# EAGLE design apa102-breakout (EAGLE 9.2.2)

## Sheet 1 of 2
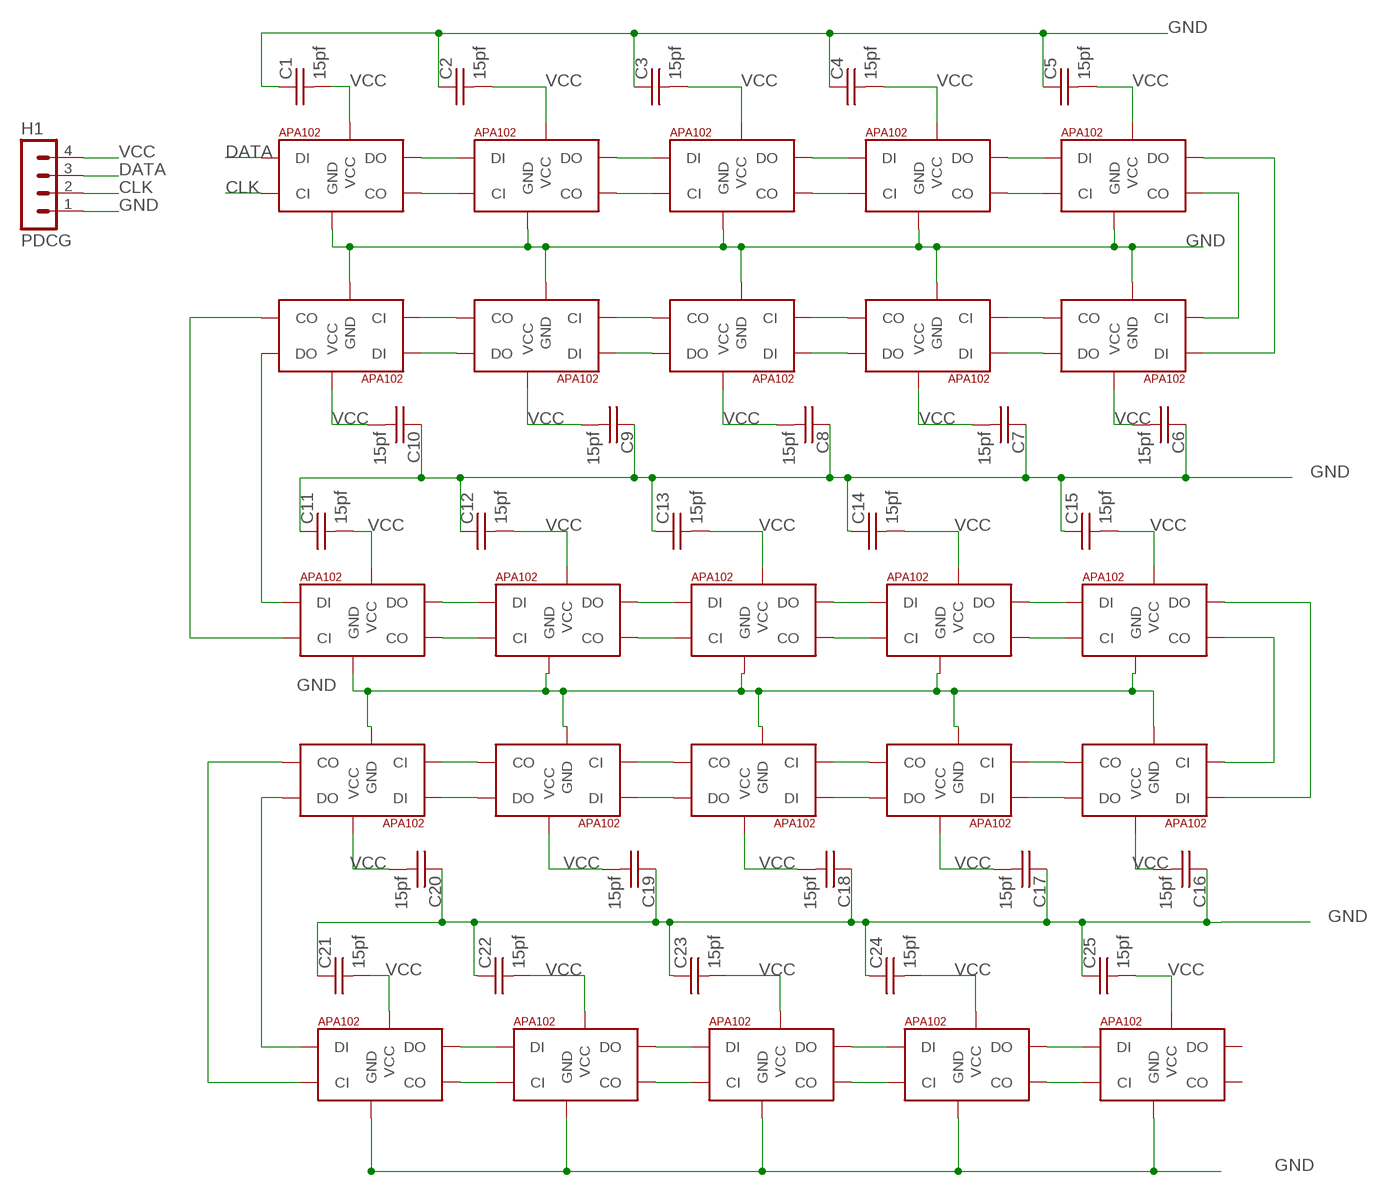
[diagram p0: schematic, sheet 1]

### Parts
C1  15pf  C-USC0805  [C0805]
C2  15pf  C-USC0805  [C0805]
C3  15pf  C-USC0805  [C0805]
C4  15pf  C-USC0805  [C0805]
C5  15pf  C-USC0805  [C0805]
C6  15pf  C-USC0805  [C0805]
C7  15pf  C-USC0805  [C0805]
C8  15pf  C-USC0805  [C0805]
C9  15pf  C-USC0805  [C0805]
C10  15pf  C-USC0805  [C0805]
C11  15pf  C-USC0805  [C0805]
C12  15pf  C-USC0805  [C0805]
C13  15pf  C-USC0805  [C0805]
C14  15pf  C-USC0805  [C0805]
C15  15pf  C-USC0805  [C0805]
C16  15pf  C-USC0805  [C0805]
C17  15pf  C-USC0805  [C0805]
C18  15pf  C-USC0805  [C0805]
C19  15pf  C-USC0805  [C0805]
C20  15pf  C-USC0805  [C0805]
C21  15pf  C-USC0805  [C0805]
C22  15pf  C-USC0805  [C0805]
C23  15pf  C-USC0805  [C0805]
C24  15pf  C-USC0805  [C0805]
C25  15pf  C-USC0805  [C0805]
H1  PDCG  MA04-1  [MA04-1]
U$2  APA1025050  [APA102_5050]
U$3  APA1025050  [APA102_5050]
U$4  APA1025050  [APA102_5050]
U$5  APA1025050  [APA102_5050]
U$6  APA1025050  [APA102_5050]
U$7  APA1025050  [APA102_5050]
U$8  APA1025050  [APA102_5050]
U$9  APA1025050  [APA102_5050]
U$10  APA1025050  [APA102_5050]
U$11  APA1025050  [APA102_5050]
U$12  APA1025050  [APA102_5050]
U$13  APA1025050  [APA102_5050]
U$14  APA1025050  [APA102_5050]
U$15  APA1025050  [APA102_5050]
U$16  APA1025050  [APA102_5050]
U$17  APA1025050  [APA102_5050]
U$18  APA1025050  [APA102_5050]
U$19  APA1025050  [APA102_5050]
U$20  APA1025050  [APA102_5050]
U$21  APA1025050  [APA102_5050]
U$22  APA1025050  [APA102_5050]
U$23  APA1025050  [APA102_5050]
U$24  APA1025050  [APA102_5050]
U$25  APA1025050  [APA102_5050]
U$26  APA1025050  [APA102_5050]

### Nets
CLK: H1.2 U$2.5(CI)
DATA: H1.3 U$2.4(DI)
GND [pwr]: C1.1 C2.1 C3.1 C4.1 C5.1 C6.1 C7.1 C8.1 C9.1 C10.1 C11.1 C12.1 C13.1 C14.1 C15.1 C16.1 C17.1 C18.1 C19.1 C20.1 C21.1 C22.1 C23.1 C24.1 C25.1 H1.1 U$2.6(GND) U$3.6(GND) U$4.6(GND) U$5.6(GND) U$6.6(GND) U$7.6(GND) U$8.6(GND) U$9.6(GND) U$10.6(GND) U$11.6(GND) U$12.6(GND) U$13.6(GND) U$14.6(GND) U$15.6(GND) U$16.6(GND) U$17.6(GND) U$18.6(GND) U$19.6(GND) U$20.6(GND) U$21.6(GND) U$22.6(GND) U$23.6(GND) U$24.6(GND) U$25.6(GND) U$26.6(GND)
N$33: U$2.3(DO) U$3.4(DI)
N$34: U$2.2(CO) U$3.5(CI)
N$35: U$3.3(DO) U$4.4(DI)
N$36: U$3.2(CO) U$4.5(CI)
N$37: U$4.3(DO) U$5.4(DI)
N$38: U$4.2(CO) U$5.5(CI)
N$39: U$5.3(DO) U$6.4(DI)
N$40: U$5.2(CO) U$6.5(CI)
N$41: U$6.3(DO) U$7.4(DI)
N$42: U$6.2(CO) U$7.5(CI)
N$43: U$7.3(DO) U$8.4(DI)
N$44: U$7.2(CO) U$8.5(CI)
N$45: U$8.2(CO) U$9.5(CI)
N$46: U$8.3(DO) U$9.4(DI)
N$47: U$9.2(CO) U$10.5(CI)
N$48: U$9.3(DO) U$10.4(DI)
N$49: U$10.2(CO) U$11.5(CI)
N$50: U$10.3(DO) U$11.4(DI)
N$51: U$11.2(CO) U$12.5(CI)
N$52: U$11.3(DO) U$12.4(DI)
N$53: U$12.3(DO) U$13.4(DI)
N$54: U$12.2(CO) U$13.5(CI)
N$55: U$13.3(DO) U$14.4(DI)
N$56: U$13.2(CO) U$14.5(CI)
N$57: U$14.3(DO) U$15.4(DI)
N$58: U$14.2(CO) U$15.5(CI)
N$59: U$15.3(DO) U$16.4(DI)
N$60: U$15.2(CO) U$16.5(CI)
N$61: U$16.3(DO) U$17.4(DI)
N$62: U$16.2(CO) U$17.5(CI)
N$64: U$17.3(DO) U$18.4(DI)
N$65: U$17.2(CO) U$18.5(CI)
N$66: U$18.2(CO) U$19.5(CI)
N$67: U$18.3(DO) U$19.4(DI)
N$68: U$19.2(CO) U$20.5(CI)
N$69: U$19.3(DO) U$20.4(DI)
N$70: U$20.2(CO) U$21.5(CI)
N$71: U$20.3(DO) U$21.4(DI)
N$72: U$21.3(DO) U$22.4(DI)
N$73: U$21.2(CO) U$22.5(CI)
N$75: U$22.3(DO) U$23.4(DI)
N$76: U$22.2(CO) U$23.5(CI)
N$77: U$23.3(DO) U$24.4(DI)
N$78: U$23.2(CO) U$24.5(CI)
N$79: U$24.3(DO) U$25.4(DI)
N$80: U$24.2(CO) U$25.5(CI)
N$81: U$25.3(DO) U$26.4(DI)
N$82: U$25.2(CO) U$26.5(CI)
VCC [pwr]: C1.2 C2.2 C3.2 C4.2 C5.2 C6.2 C7.2 C8.2 C9.2 C10.2 C11.2 C12.2 C13.2 C14.2 C15.2 C16.2 C17.2 C18.2 C19.2 C20.2 C21.2 C22.2 C23.2 C24.2 C25.2 H1.4 U$2.1(VCC) U$3.1(VCC) U$4.1(VCC) U$5.1(VCC) U$6.1(VCC) U$7.1(VCC) U$8.1(VCC) U$9.1(VCC) U$10.1(VCC) U$11.1(VCC) U$12.1(VCC) U$13.1(VCC) U$14.1(VCC) U$15.1(VCC) U$16.1(VCC) U$17.1(VCC) U$18.1(VCC) U$19.1(VCC) U$20.1(VCC) U$21.1(VCC) U$22.1(VCC) U$23.1(VCC) U$24.1(VCC) U$25.1(VCC) U$26.1(VCC)
Unconnected: U$26.2(CO) U$26.3(DO)

## Sheet 2 of 2
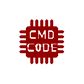
[diagram p1: schematic, sheet 2]

### Parts
U$1  CMD_C0DE_LOGOCMD_C0DE_LOGO_TOP  [CMD_C0DE_LOGO_TOP]

## Library data of the parts
C1-C25 = apa102-test-board:C-US: CAPACITOR, American symbol
H1 = apa102-test-board:MA04-1: PIN HEADER; OC_FARNELL: unknown; OC_NEWARK: unknown
U$1 = apa102-test-board:CMD_C0DE_LOGO
U$2-U$26 = apa102-test-board:APA102: APA102C 5050 RGB LED -- Adafruit DotStar Single LED Pixel Product Page: https://www.adafruit.com/products/2343 Datasheet: https://cdn-shop.adafruit.com/product-files/2343/APA102C.pdf

## Net classes
1 pwr: width 0.406 mm

## Board
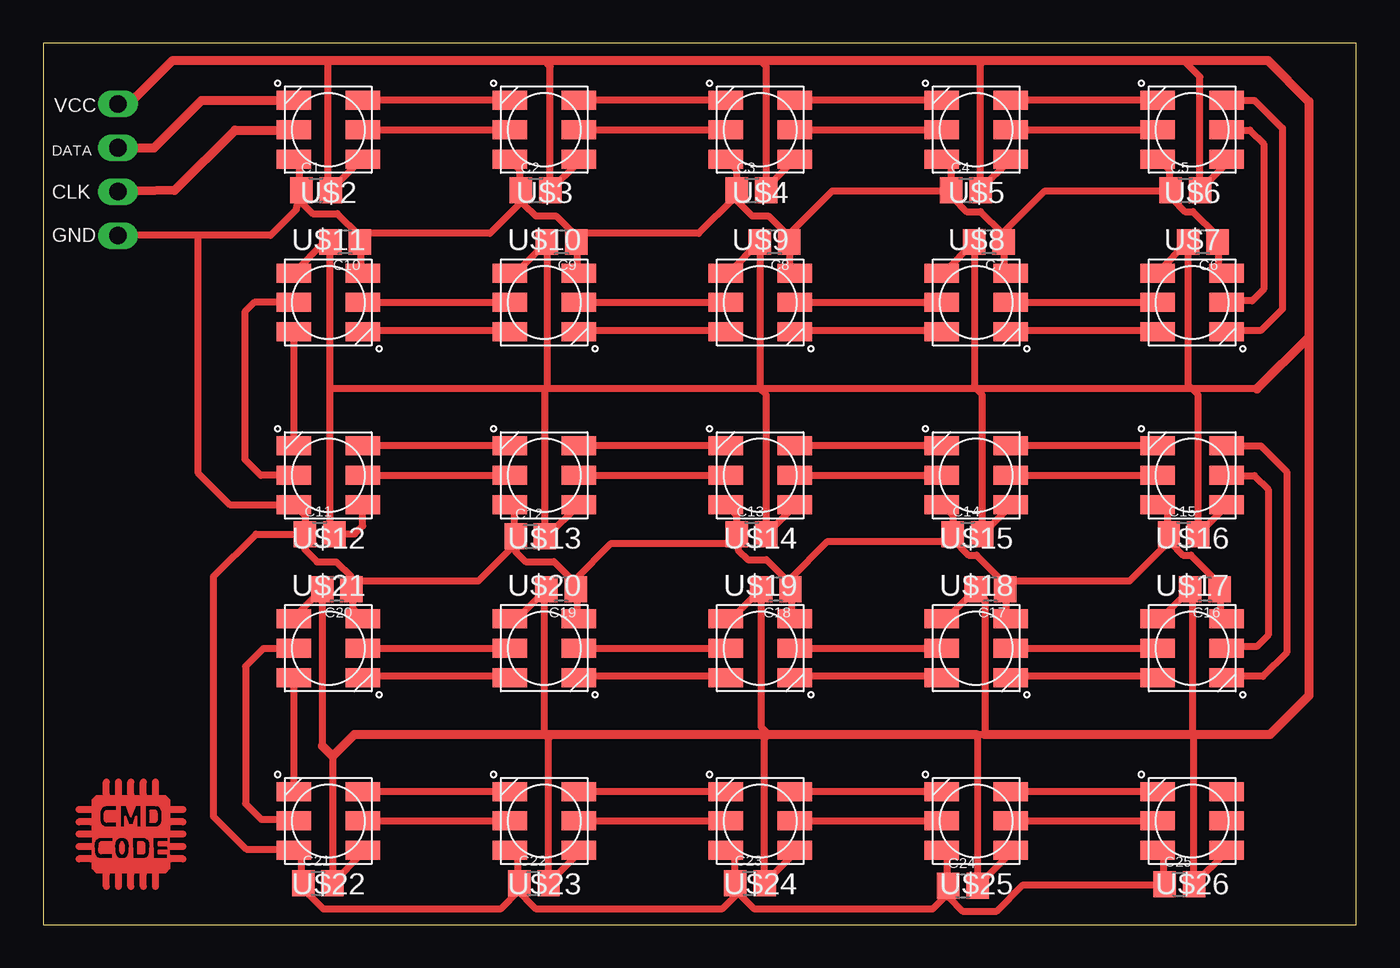
[diagram p2: board, top side]
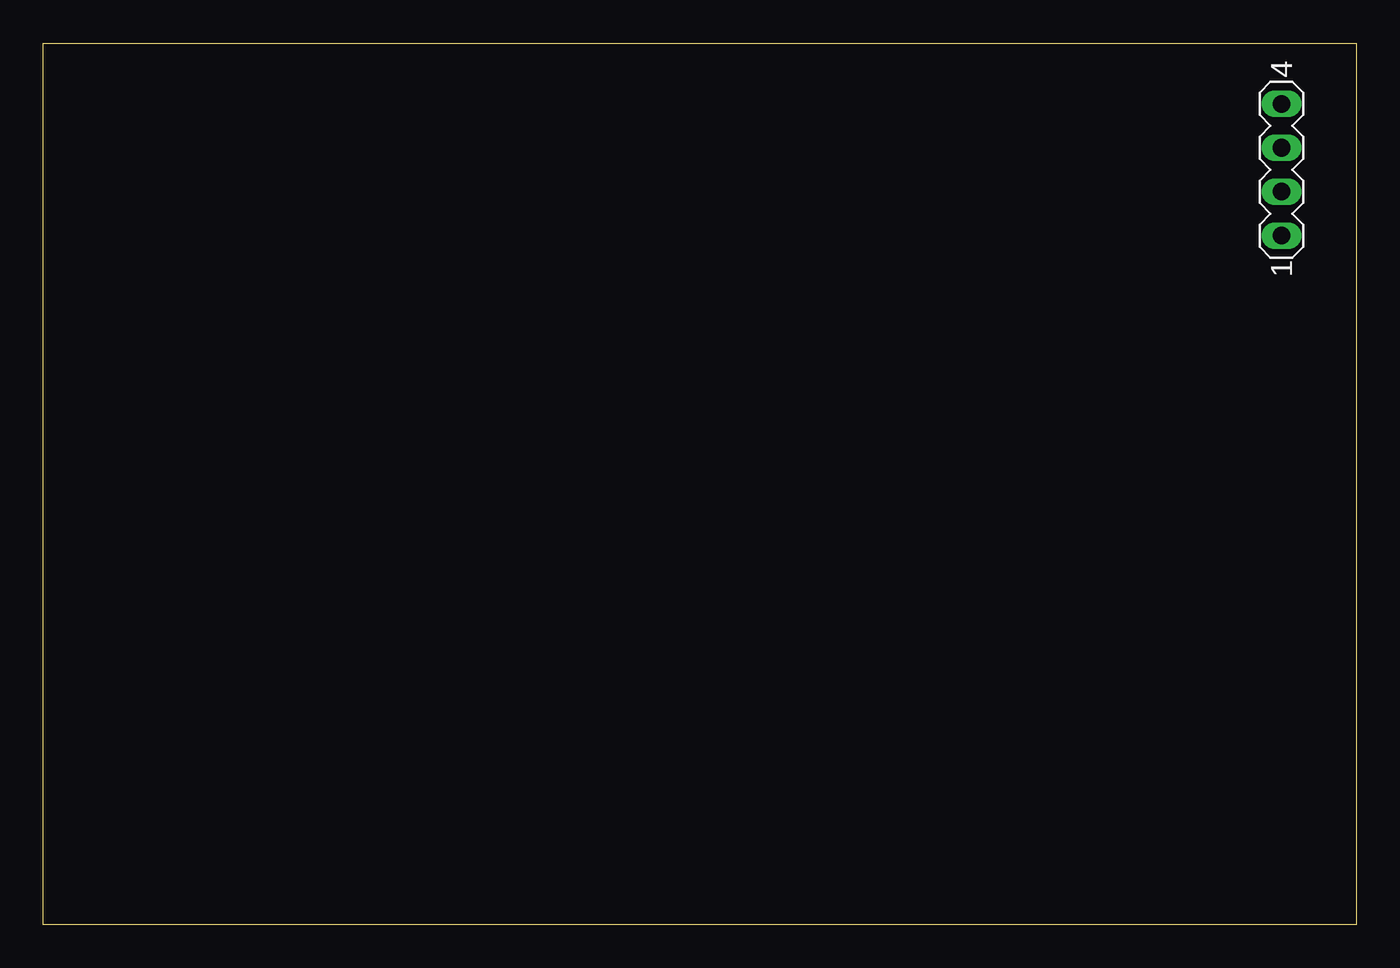
[diagram p3: board, bottom side, seen from below]

Size 76 x 51 mm. Coordinates in mm from the lower left corner, seen from the top.
Outline: 0,0 76,0 76,51 0,51 0,0
Copper layers (1*16): Top 0.035mm / dielectric 1.5mm / Bottom 0.035mm
Design rules "OthermillDRC_1_100_v2 *": minimum track width 8mil, minimum drill 0.8mm, track to track 0.256540625mm, track to pad 0.256540625mm, pad to pad 0.256540625mm, via to via 0.256540625mm, smd to smd 0mil, copper to edge 0mil, drill to drill 1mil, minimum pad ring 10mil, minimum via ring 10mil, stop-mask expansion 1mil, vias tented up to drill 30mil, thermal gap 10mil

### Footprints (pad centres in the part's own frame; a part is rotated, then mirrored left to right if it is on the bottom)
C0805 = smd 1.3 x 1.5: 1 -0.85,0; 2 0.85,0
MA04-1 = drill 1.016 long: 1 -3.81,0; 2 -1.27,0; 3 1.27,0; 4 3.81,0
APA102_5050 = smd 2 x 1.1: 1 2,-1.7; 2 2,0; 3 2,1.7; 4 -2,1.7; 5 -2,0; 6 -2,-1.7

### Placement (x,y rotation side)
C1  15.79,42.5 0 top
C2  28.5,42.5 0 top
C3  41,42.5 0 top
C4  53.4,42.5 0 top
C5  66.1,42.5 0 top
C6  67.11,39.5 180 top
C7  54.74,39.5 180 top
C8  42.32,39.5 180 top
C9  30,39.5 180 top
C10  17.48,39.5 180 top
C11  16,22.6 0 top
C12  28.19,22.47 0 top
C13  41,22.6 0 top
C14  53.5,22.6 0 top
C15  66,22.6 0 top
C16  67.24,19.4 180 top
C17  54.82,19.4 180 top
C18  42.4,19.4 180 top
C19  29.98,19.4 180 top
C20  17,19.4 180 top
C21  15.9,2.4 0 top
C22  28.4,2.4 0 top
C23  40.9,2.4 0 top
C24  53.24,2.26 0 top
C25  65.76,2.34 0 top
H1  4.33,43.68 90 bottom
U$1  5.08,5.55 0 top
U$2  16.5,46 0 top
U$3  29,46 0 top
U$4  41.5,46 0 top
U$5  54,46 0 top
U$6  66.5,46 0 top
U$7  66.5,36 180 top
U$8  54,36 180 top
U$9  41.5,36 180 top
U$10  29,36 180 top
U$11  16.5,36 180 top
U$12  16.5,26 0 top
U$13  29,26 0 top
U$14  41.5,26 0 top
U$15  54,26 0 top
U$16  66.5,26 0 top
U$17  66.5,16 180 top
U$18  54,16 180 top
U$19  41.5,16 180 top
U$20  29,16 180 top
U$21  16.5,16 180 top
U$22  16.5,6 0 top
U$23  29,6 0 top
U$24  41.5,6 0 top
U$25  54,6 0 top
U$26  66.5,6 0 top

### Tracks (layer width: path | path; a pad name or v marks a point on that pad's centre or on a via)
CLK
  Top 0.203: 14.48,45.97 U$2.5
  Top 0.508: 14.48,45.97 11.11,45.97 7.61,42.48 H1.2
DATA
  Top 0.203: 14.48,47.7 U$2.4
  Top 0.508: 14.48,47.7 9.17,47.7 6.42,44.95 H1.3
GND
  Top 0.406: C10.1 18.39,39.42 18.39,37.81 U$11.6 | C1.1 14.83,42.53 14.83,44.02 14.6,44.25 U$2.6 | C10.1 18.27,39.65 18.27,39.88 17.02,41.13 15.61,41.13 14.94,41.8 14.94,42.3 C1.1 | 8.95,39.88 13.15,39.88 14.65,41.38 C1.1 | 8.95,39.88 4.37,39.88 H1.1 | U$7.6 68.39,37.81 68.04,38.16 68.04,39.42 C6.1 67.93,39.65 67.93,39.88 66.55,41.26 66.09,41.26 65.28,42.07 65.28,42.3 C5.1 | C5.1 65.17,42.53 65.17,43.67 64.59,44.25 U$6.6 | C7.1 55.63,39.42 55.63,38.16 55.97,37.81 U$8.6 | C4.1 52.52,42.53 52.52,43.79 52.06,44.25 U$5.6 | C7.1 55.51,39.65 55.51,40 54.25,41.26 53.44,41.26 52.64,42.07 52.64,42.41 C4.1 | C9.1 30.92,39.42 30.92,37.81 U$10.6 | C2.1 27.58,42.53 27.58,43.67 27.01,44.25 U$3.6 | C9.1 30.8,39.65 30.8,39.88 29.68,41.01 28.5,41.01 27.81,41.7 27.81,42.41 C2.1 | C8.1 43.22,39.42 43.22,38.04 43.45,37.81 U$9.6 | C3.1 40.11,42.53 40.11,43.67 39.54,44.25 U$4.6 | C8.1 43.1,39.65 43.1,39.88 41.98,41.01 41.03,41.01 40.11,41.93 40.11,42.3 C3.1 | C9.1 30.92,40 37.93,40 40,42.07 C3.1 | C4.1 52.55,42.46 45.68,42.46 43.22,40 C8.1 | C5.1 65.24,42.46 57.98,42.46 55.63,40.11 C7.1 | C10.1 18.39,40 25.86,40 27.7,41.84 C2.1 | C22.1 27.47,2.41 27.47,3.79 27.01,4.25 U$23.6 | C22.1 27.55,1.99 26.46,0.9 16.23,0.9 15.17,1.95 15.17,2.3 C21.1 14.94,2.41 14.94,3.91 14.6,4.25 U$22.6 14.37,4.37 11.75,4.37 9.86,6.25 9.86,20.15 12.31,22.6 C11.1 | C23.1 40,2.41 40,3.79 39.54,4.25 U$24.6 | U$26.6 64.59,4.25 64.82,4.02 64.82,2.41 C25.1 64.71,2.3 56.71,2.3 55.19,0.78 53.22,0.78 52.41,1.58 52.41,2.07 C24.1 | C24.1 52.3,2.3 52.3,4.02 52.06,4.25 U$25.6 | C23.1 40.23,2.3 40.23,1.84 41.17,0.9 51.47,0.9 52.3,1.72 C24.1
  Top 0.406: C22.1 27.35,2.07 28.53,0.9 39.28,0.9 40.11,1.72 C23.1 | C17.1 55.74,19.31 55.74,18.05 55.97,17.82 U$18.6 | C14.1 52.64,22.64 52.64,23.68 52.06,24.25 U$15.6 | C17.1 55.63,19.54 55.63,19.77 54.02,21.38 53.56,21.38 52.64,22.3 52.64,22.41 C14.1 | U$17.6 68.39,17.82 68.16,18.05 68.16,19.31 C16.1 68.04,19.54 68.04,19.77 66.43,21.38 65.97,21.38 65.17,22.18 65.17,22.41 C15.1 | C15.1 65.05,22.64 65.05,23.79 64.59,24.25 U$16.6 | C17.1 55.74,19.88 62.87,19.88 65.05,22.07 C15.1 | C18.1 43.33,19.31 43.33,17.93 43.45,17.82 U$19.6 | C13.1 40.11,22.64 40.11,23.68 39.54,24.25 U$14.6 | C18.1 43.1,19.54 43.1,19.88 41.86,21.12 40.78,21.12 40.23,21.67 40.23,22.41 C13.1 | C20.1 17.93,19.31 17.93,18.27 18.39,17.82 U$21.6 | C20.1 17.82,19.54 17.82,20.15 16.97,21 15.85,21 15.15,21.7 C11.1 | C19.1 30.92,19.31 30.92,17.82 U$20.6 | C12.1 27.24,22.53 27.24,24.02 27.01,24.25 U$13.6 | C19.1 30.69,19.54 30.69,19.88 29.56,21.01 27.91,21.01 27.35,21.56 27.35,22.3 C12.1 | C20.1 17.93,19.88 25.17,19.88 27.24,21.95 C12.1 | C13.1 40.11,22.07 32.87,22.07 30.8,20 C19.1 | C14.1 52.52,22.18 45.4,22.18 43.22,20 C18.1 | 8.95,39.88 8.95,26.15 10.8,24.3 U$12.6 15.15,23.65 C11.1
N$33
  Top 0.203: U$2.3 | 26.89,47.7 U$3.4
  Top 0.406: 26.89,47.7 U$2.3
N$34
  Top 0.203: 18.5,45.97 U$2.2 | 26.89,45.97 U$3.5
  Top 0.406: 26.89,45.97 18.5,45.97
N$35
  Top 0.203: 31.03,47.7 U$3.3 | 39.42,47.7 U$4.4
  Top 0.406: 39.42,47.7 31.03,47.7
N$36
  Top 0.203: 31.03,45.97 U$3.2 | 39.42,45.97 U$4.5
  Top 0.406: 39.42,45.97 31.03,45.97
N$37
  Top 0.203: 43.56,47.7 U$4.3 | 51.95,47.7 U$5.4
  Top 0.406: 51.95,47.7 43.56,47.7
N$38
  Top 0.203: 43.56,45.97 U$4.2 | 51.95,45.97 U$5.5
  Top 0.406: 51.95,45.97 43.56,45.97
N$39
  Top 0.203: 56.09,47.7 U$5.3 | 64.48,47.7 U$6.4
  Top 0.406: 64.48,47.7 56.09,47.7
N$40
  Top 0.203: 56.09,45.97 U$5.2 | 64.48,45.97 U$6.5
  Top 0.406: 64.48,45.97 56.09,45.97
N$41
  Top 0.203: 68.5,34.37 U$7.4 | U$6.3
  Top 0.406: 68.5,34.37 70.46,34.37 71.72,35.62 71.72,46.08 70.1,47.7 U$6.3
N$42
  Top 0.203: 68.5,36.09 U$7.5 | 68.5,45.97 U$6.2
  Top 0.406: 68.5,36.09 69.98,36.09 70.64,36.76 70.64,45.18 69.85,45.97 68.5,45.97
N$43
  Top 0.203: 56.09,34.37 U$8.4 | 64.48,34.37 U$7.3
  Top 0.406: 64.48,34.37 56.09,34.37
N$44
  Top 0.203: 56.09,35.97 U$8.5 | 64.48,35.97 U$7.2
  Top 0.406: 64.48,35.97 56.09,35.97
N$45
  Top 0.203: 43.56,35.97 U$9.5 | 51.95,35.97 U$8.2
  Top 0.406: 51.95,35.97 43.56,35.97
N$46
  Top 0.203: 43.56,34.37 U$9.4 | 51.95,34.37 U$8.3
  Top 0.406: 51.95,34.37 43.56,34.37
N$47
  Top 0.203: 31.03,35.97 U$10.5 | 39.42,35.97 U$9.2
  Top 0.406: 39.42,35.97 31.03,35.97
N$48
  Top 0.203: 31.03,34.37 U$10.4 | 39.42,34.37 U$9.3
  Top 0.406: 39.42,34.37 31.03,34.37
N$49
  Top 0.203: 18.5,35.97 U$11.5 | 26.89,35.97 U$10.2
  Top 0.406: 26.89,35.97 18.5,35.97
N$50
  Top 0.203: 18.5,34.37 U$11.4 | 26.89,34.37 U$10.3
  Top 0.406: 26.89,34.37 18.5,34.37
N$51
  Top 0.406: U$11.2 12.21,36 11.67,35.46 11.67,26.93 12.6,26 U$12.5
N$52
  Top 0.203: 14.48,27.81 U$12.4 | 14.48,34.25 U$11.3
  Top 0.406: 14.48,34.25 14.48,27.81
N$53
  Top 0.203: U$12.3 | 26.89,27.7 U$13.4
  Top 0.406: 26.89,27.7 U$12.3
N$54
  Top 0.203: 18.5,25.98 U$12.2 | 26.89,25.98 U$13.5
  Top 0.406: 26.89,25.98 18.5,25.98
N$55
  Top 0.203: 31.03,27.7 U$13.3 | 39.42,27.7 U$14.4
  Top 0.406: 39.42,27.7 31.03,27.7
N$56
  Top 0.203: 31.03,25.98 U$13.2 | 39.42,25.98 U$14.5
  Top 0.406: 39.42,25.98 31.03,25.98
N$57
  Top 0.203: 43.56,27.7 U$14.3 | 51.95,27.7 U$15.4
  Top 0.406: 51.95,27.7 43.56,27.7
N$58
  Top 0.203: 43.56,25.98 U$14.2 | 51.95,25.98 U$15.5
  Top 0.406: 51.95,25.98 43.56,25.98
N$59
  Top 0.203: 56.09,27.7 U$15.3 | 64.48,27.7 U$16.4
  Top 0.406: 64.48,27.7 56.09,27.7
N$60
  Top 0.203: 56.09,25.98 U$15.2 | 64.48,25.98 U$16.5
  Top 0.406: 64.48,25.98 56.09,25.98
N$61
  Top 0.203: 68.5,14.37 U$17.4 | U$16.3
  Top 0.406: 68.5,14.37 70.6,14.37 71.96,15.73 71.96,26.22 70.48,27.7 U$16.3
N$62
  Top 0.203: 68.5,16.09 U$17.5 | 68.5,25.98 U$16.2
  Top 0.406: 68.5,16.09 70.23,16.09 70.9,16.76 70.9,25.18 70.1,25.98 68.5,25.98
N$64
  Top 0.203: 56.09,14.37 U$18.4 | 64.48,14.37 U$17.3
  Top 0.406: 64.48,14.37 56.09,14.37
N$65
  Top 0.203: 56.09,15.98 U$18.5 | 64.48,15.98 U$17.2
  Top 0.406: 64.48,15.98 56.09,15.98
N$66
  Top 0.203: 43.56,15.98 U$19.5 | 51.95,15.98 U$18.2
  Top 0.406: 51.95,15.98 43.56,15.98
N$67
  Top 0.203: 43.56,14.37 U$19.4 | 51.95,14.37 U$18.3
  Top 0.406: 51.95,14.37 43.56,14.37
N$68
  Top 0.203: 31.03,15.98 U$20.5 | 39.42,15.98 U$19.2
  Top 0.406: 39.42,15.98 31.03,15.98
N$69
  Top 0.203: 31.03,14.37 U$20.4 | 39.42,14.37 U$19.3
  Top 0.406: 39.42,14.37 31.03,14.37
N$70
  Top 0.203: 18.5,15.98 U$21.5 | 26.89,15.98 U$20.2
  Top 0.406: 26.89,15.98 18.5,15.98
N$71
  Top 0.203: 18.5,14.37 U$21.4 | 26.89,14.37 U$20.3
  Top 0.406: 26.89,14.37 18.5,14.37
N$72
  Top 0.203: 14.48,7.7 U$22.4 | 14.48,14.25 U$21.3
  Top 0.406: 14.48,14.25 14.48,7.7
N$73
  Top 0.203: 14.48,6.09 U$22.5 | 14.48,15.98 U$21.2
  Top 0.406: 14.48,6.09 12.62,6.09 11.71,7.01 11.71,14.94 12.74,15.98 14.48,15.98
N$75
  Top 0.203: U$22.3 | 26.89,7.7 U$23.4
  Top 0.406: 26.89,7.7 U$22.3
N$76
  Top 0.203: 18.5,5.98 U$22.2 | 26.89,5.98 U$23.5
  Top 0.406: 26.89,5.98 18.5,5.98
N$77
  Top 0.203: 31.03,7.7 U$23.3 | 39.42,7.7 U$24.4
  Top 0.406: 39.42,7.7 31.03,7.7
N$78
  Top 0.203: 31.03,5.98 U$23.2 | 39.42,5.98 U$24.5
  Top 0.406: 39.42,5.98 31.03,5.98
N$79
  Top 0.203: 43.56,7.7 U$24.3 | 51.95,7.7 U$25.4
  Top 0.406: 51.95,7.7 43.56,7.7
N$80
  Top 0.203: 43.56,5.98 U$24.2 | 51.95,5.98 U$25.5
  Top 0.406: 51.95,5.98 43.56,5.98
N$81
  Top 0.203: 56.09,7.7 U$25.3 | 64.48,7.7 U$26.4
  Top 0.406: 64.48,7.7 56.09,7.7
N$82
  Top 0.203: 56.09,5.98 U$25.2 | 64.48,5.98 U$26.5
  Top 0.406: 64.48,5.98 56.09,5.98
VCC
  Top 0.406: H1.4 4.99,47.49 | 70.25,31 66.5,31 | 66.5,31 54,31 | 54,31 41.5,31 | 41.5,31 29,31 | U$17.1 64.69,17.7 C16.2 66.5,19.29 66.5,11 66.61,10.89 C25.2 68.5,4.23 U$26.1 | 16.5,50 16.5,42.64 C1.2 18.44,44.3 U$2.1 | 29,50 29.35,49.65 C2.2 31,44.15 U$3.1 | 41.5,50 41.85,49.65 C3.2 41.85,42.65 U$4.1 | 54,50 54.25,49.75 C4.2 54.25,42.55 U$5.1 | 66,50 66.95,49.05 C5.2 68.5,44.05 U$6.1 | 66.5,31 66.26,31.24 C6.2 64.5,37.74 U$7.1 | 66.5,31 66.85,30.65 C15.2 68.5,24.25 U$16.1 | 54,31 54.35,30.65 C14.2 56,24.25 U$15.1 | 54,31 53.89,31.11 C7.2 52.09,37.7 U$8.1 | 41.5,31 41.5,39.47 C8.2 39.67,37.7 U$9.1 | 41.5,31 41.85,30.65 C13.2 43.5,24.25 U$14.1 | 29.04,31.04 29,31 | U$10.1 27.35,37.7 C9.2 29.15,31.15 29.04,31.04 | 29.04,31.04 C12.2 29.17,22.47 U$13.1 | U$11.1 16.3,39.5 C10.2 16.6,39.47 16.6,31 | 16.75,9.75 C21.2 18.5,4.15 U$22.1 | 16.15,10.35 C20.2 14.5,17.75 U$21.1 | U$20.1 27.43,17.7 C19.2 29,19.27 29,11 29.25,10.75 C22.2 31,4.15 U$23.1 | U$24.1 43.5,4.15 C23.2 41.75,10.75 41.5,11 42,11 41.55,11.45 C18.2 39.85,17.7 U$19.1 | U$25.1 56,4.17 C24.2 54.09,10.91 54,11 54.5,11 54.5,18.87 C17.2 52.27,17.7 U$18.1 | U$12.1 18.5,23.07 18.03,22.61 C11.2 16.6,22.85 16.6,31 | 29,31 16.6,31
  Top 0.508: 4.99,47.49 7.5,50 16.5,50 29,50 41.5,50 54,50 66,50 70.88,50 73.26,47.62 73.26,34.01 73.25,34 | 73.25,34 70.25,31 | 73.25,34 73.25,13.25 71,11 66.5,11 54.5,11 | 54,11 42,11 | 41.5,11 29,11 18,11 16.75,9.75 16.15,10.35

### Text on the board
tNames: VCC | DATA | CLK | GND